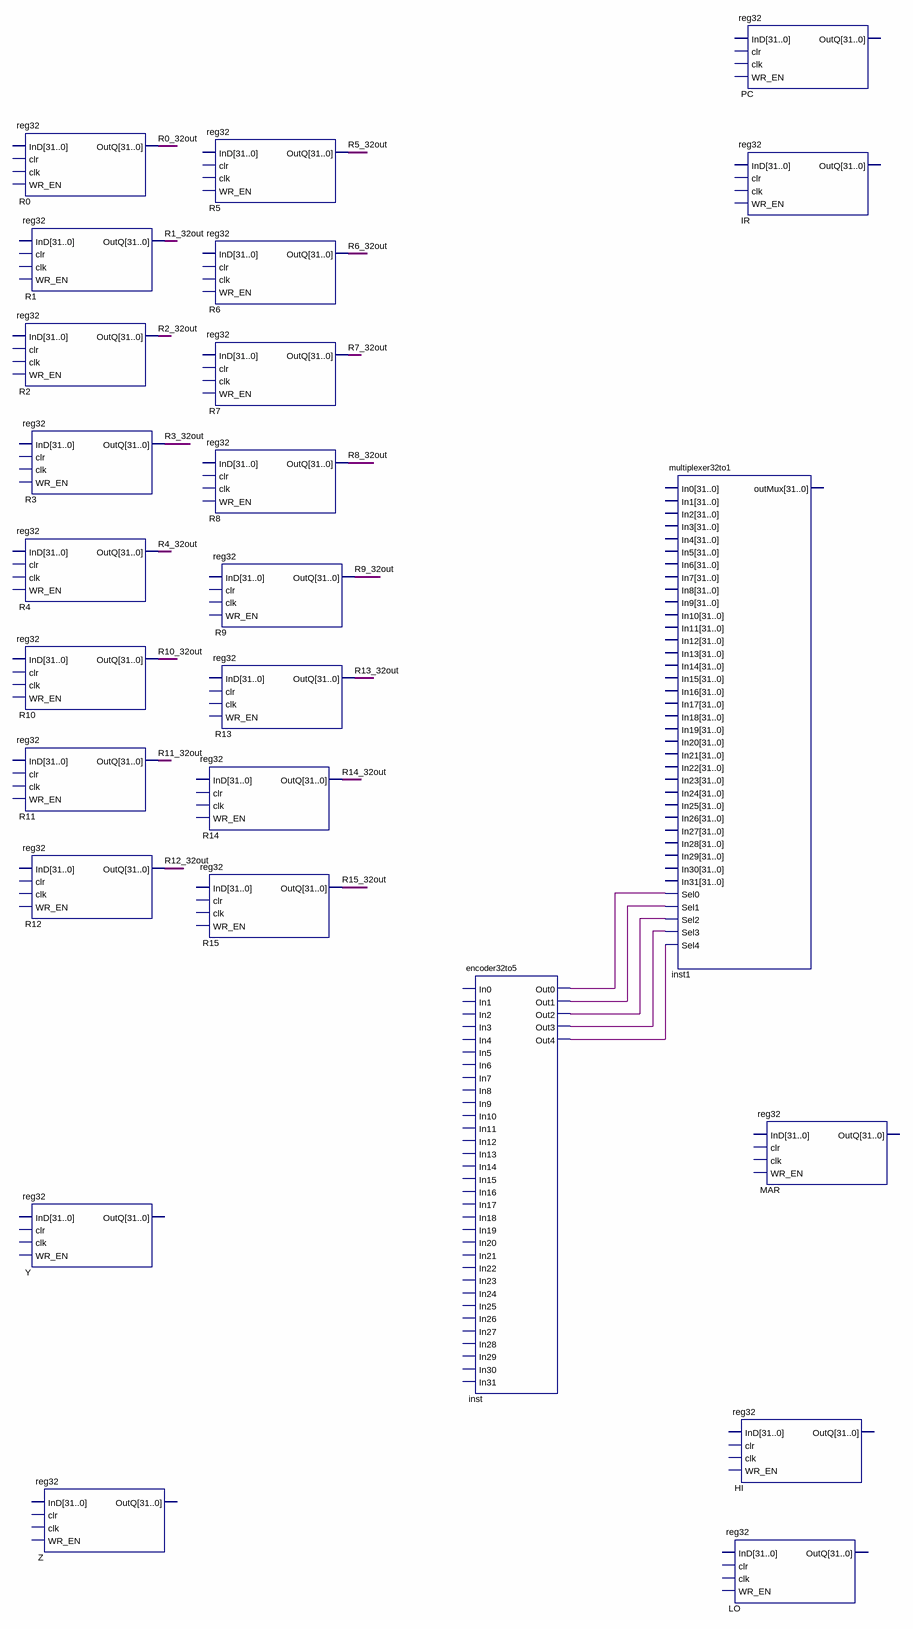
[diagram p0: schematic sheet]
// Quartus schematic phase1.bdf as structural Verilog: 25 symbols, 0 pins
module phase1 (
);

  wire inst_out0, inst_out1, inst_out2, inst_out3, inst_out4, R0_32out, R1_32out, R2_32out, R3_32out,
       R4_32out, R5_32out, R6_32out, R7_32out, R8_32out, R9_32out, R10_32out, R11_32out, R12_32out,
       R13_32out, R14_32out, R15_32out;

  reg32 R0 (.OutQ(R0_32out));  // open: InD, clr, clk, WR_EN
  reg32 R1 (.OutQ(R1_32out));  // open: InD, clr, clk, WR_EN
  reg32 R2 (.OutQ(R2_32out));  // open: InD, clr, clk, WR_EN
  reg32 R3 (.OutQ(R3_32out));  // open: InD, clr, clk, WR_EN
  reg32 R4 (.OutQ(R4_32out));  // open: InD, clr, clk, WR_EN
  reg32 R10 (.OutQ(R10_32out));  // open: InD, clr, clk, WR_EN
  reg32 R11 (.OutQ(R11_32out));  // open: InD, clr, clk, WR_EN
  reg32 R12 (.OutQ(R12_32out));  // open: InD, clr, clk, WR_EN
  reg32 Y ();  // open: InD, clr, clk, WR_EN, OutQ
  reg32 Z ();  // open: InD, clr, clk, WR_EN, OutQ
  reg32 R14 (.OutQ(R14_32out));  // open: InD, clr, clk, WR_EN
  reg32 R15 (.OutQ(R15_32out));  // open: InD, clr, clk, WR_EN
  reg32 R5 (.OutQ(R5_32out));  // open: InD, clr, clk, WR_EN
  reg32 R6 (.OutQ(R6_32out));  // open: InD, clr, clk, WR_EN
  reg32 R7 (.OutQ(R7_32out));  // open: InD, clr, clk, WR_EN
  reg32 R8 (.OutQ(R8_32out));  // open: InD, clr, clk, WR_EN
  reg32 R9 (.OutQ(R9_32out));  // open: InD, clr, clk, WR_EN
  reg32 R13 (.OutQ(R13_32out));  // open: InD, clr, clk, WR_EN
  encoder32to5 inst (
    .Out0(inst_out0), .Out1(inst_out1), .Out2(inst_out2), .Out3(inst_out3), .Out4(inst_out4));  // open: In0, In1, In2, In3, In4, In5, In6, In7, In8, In9, In10, In11, In12, In13, In14, In15, In16, In17, In18, In19, In20, In21, In22, In23, In24, In25, In26, In27, In28, In29, In30, In31
  multiplexer32to1 inst1 (
    .Sel0(inst_out0), .Sel1(inst_out1), .Sel2(inst_out2), .Sel3(inst_out3), .Sel4(inst_out4));  // open: In0, In1, In2, In3, In4, In5, In6, In7, In8, In9, In10, In11, In12, In13, In14, In15, In16, In17, In18, In19, In20, In21, In22, In23, In24, In25, In26, In27, In28, In29, In30, In31, outMux
  reg32 PC ();  // open: InD, clr, clk, WR_EN, OutQ
  reg32 IR ();  // open: InD, clr, clk, WR_EN, OutQ
  reg32 MAR ();  // open: InD, clr, clk, WR_EN, OutQ
  reg32 HI ();  // open: InD, clr, clk, WR_EN, OutQ
  reg32 LO ();  // open: InD, clr, clk, WR_EN, OutQ
endmodule
